# EAGLE design board (EAGLE 9.6.2)
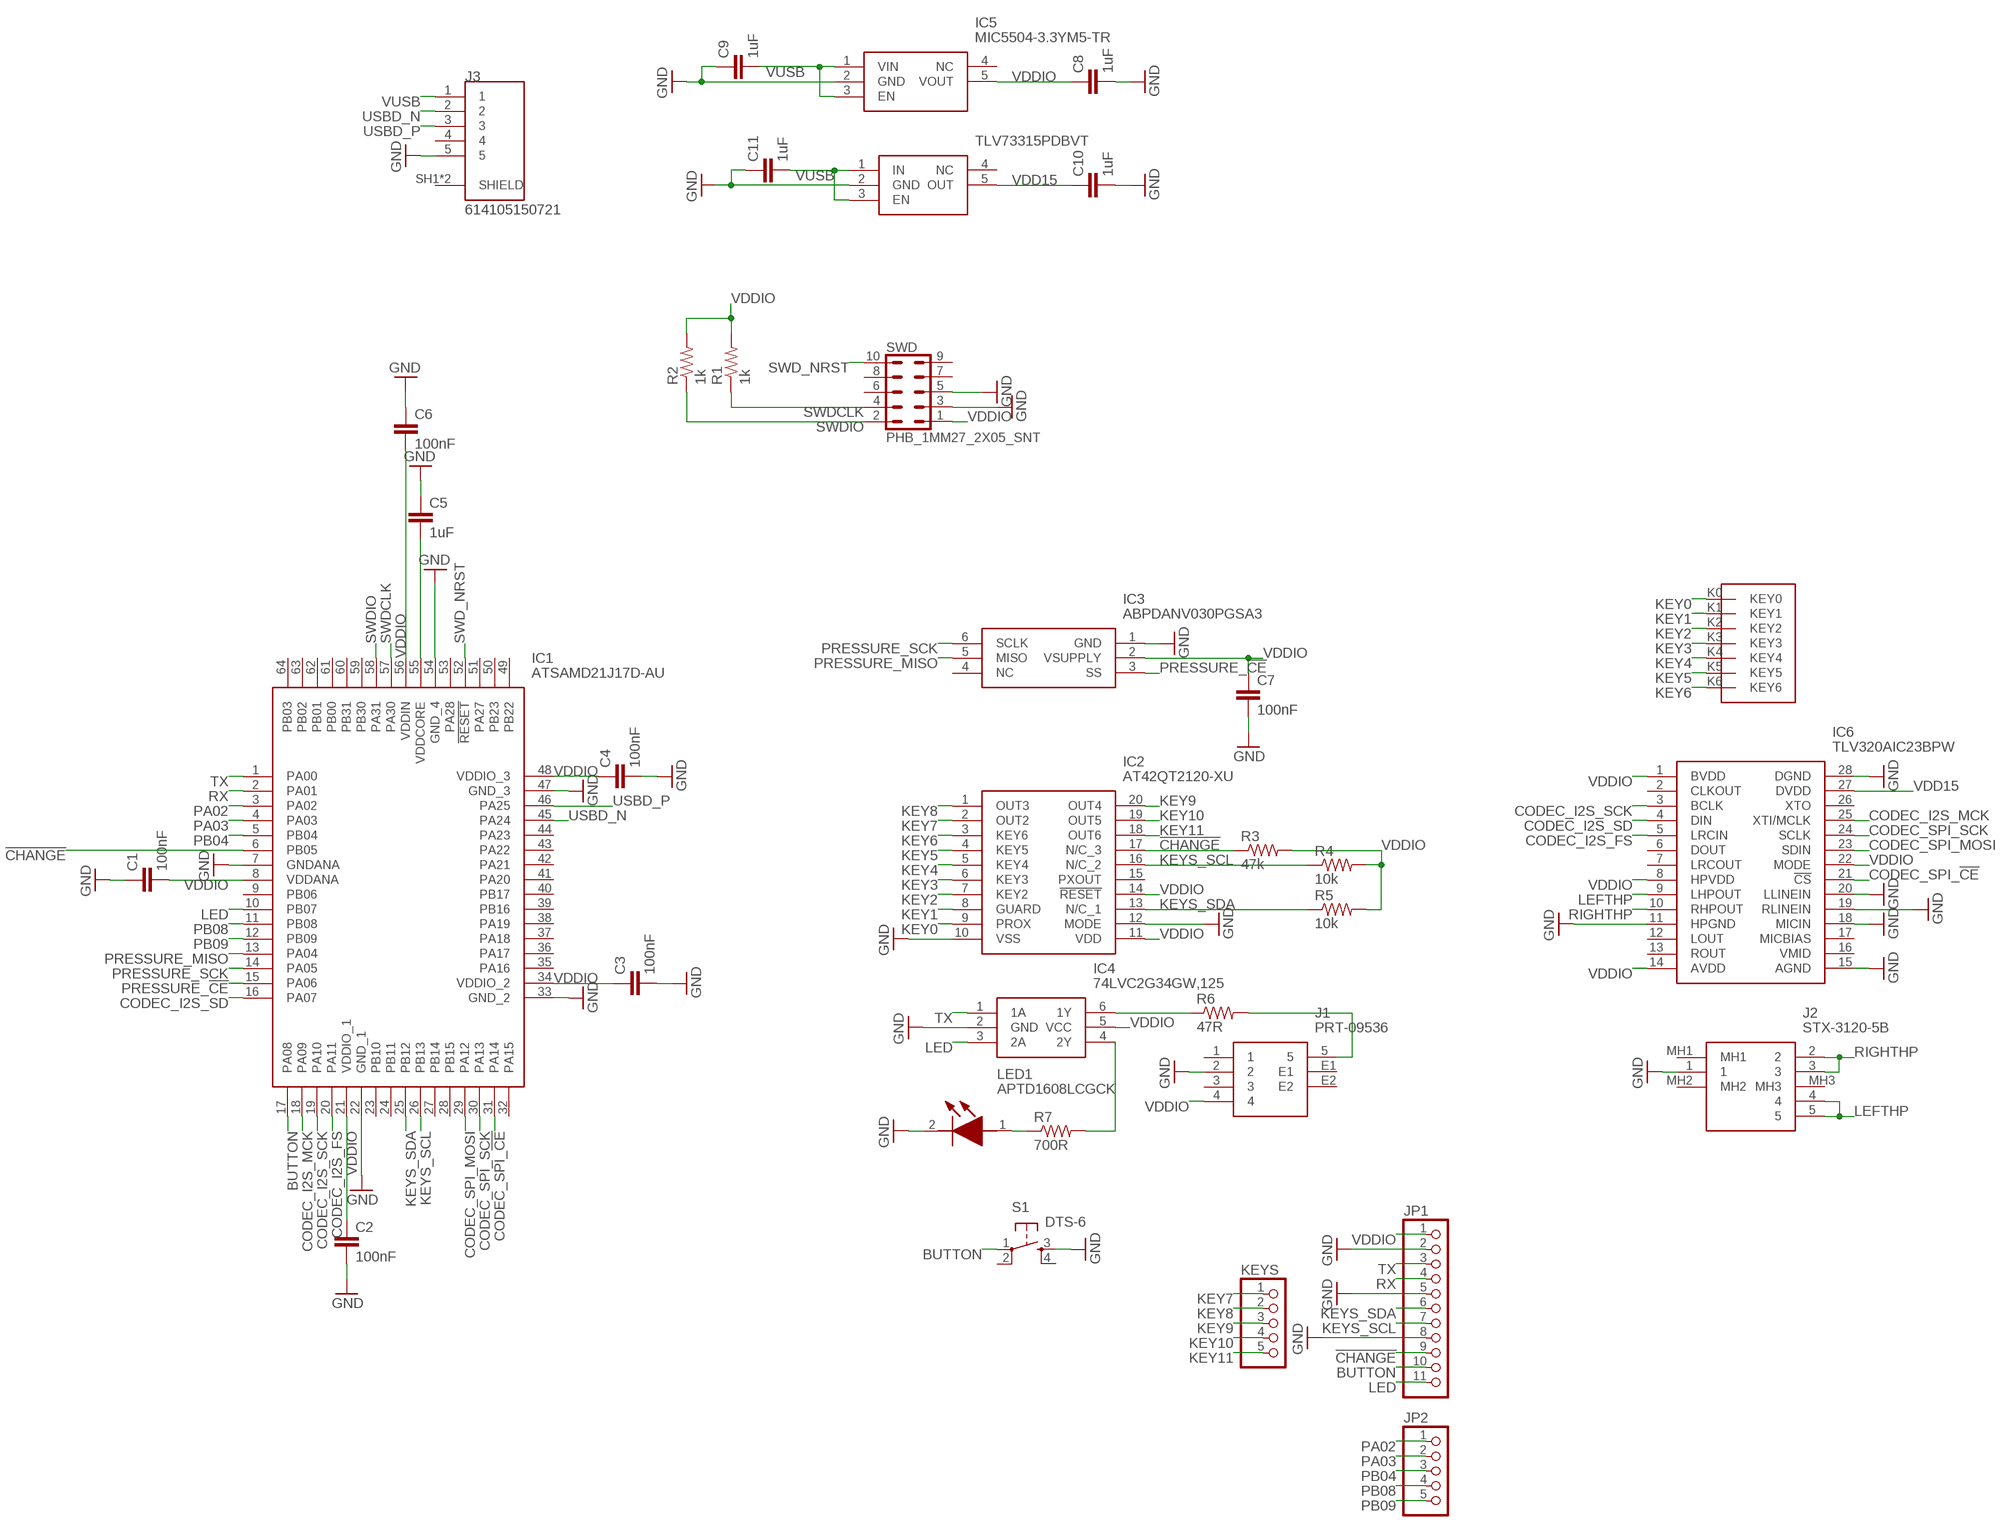
[diagram p0: schematic, sheet 1]

## Parts
C1  100nF  C-EUC0603  [C0603]
C2  100nF  C-EUC0603  [C0603]
C3  100nF  C-EUC0603  [C0603]
C4  100nF  C-EUC0603  [C0603]
C5  1uF  C-EUC0603  [C0603]
C6  100nF  C-EUC0603  [C0603]
C7  100nF  C-EUC0603  [C0603]
C8  1uF  C-EUC0603  [C0603]
C9  1uF  C-EUC0603  [C0603]
C10  1uF  C-EUC0603  [C0603]
C11  1uF  C-EUC0603  [C0603]
IC1  ATSAMD21J17D-AU  [QFP50P1200X1200X120-64N]
IC2  AT42QT2120-XU  [SOP65P638X120-20N]
IC3  ABPDANV030PGSA3  [ABPDANV030PGSA3]
IC4  74LVC2G34GW,125  [SOP65P210X110-6N]
IC5  MIC5504-3.3YM5-TR  [SOT95P280X145-5N]
IC6  TLV320AIC23BPW  [SOP65P640X120-28N]
J1  PRT-09536  [PRT09536]
J2  STX-3120-5B  [STX31205B]
J3  614105150721  [WURTH_614105150721]
JP1  PINHD-1X11  [1X11]
JP2  PINHD-1X5  [1X05]
KEYS  PINHD-1X5  [1X05]
LED1  APTD1608LCGCK  [APT1608CGCK]
R1  1k  R-US_R0603  [R0603]
R2  1k  R-US_R0603  [R0603]
R3  47k  R-US_R0603  [R0603]
R4  10k  R-US_R0603  [R0603]
R5  10k  R-US_R0603  [R0603]
R6  47R  R-US_R0603  [R0603]
R7  700R  R-US_R0603  [R0603]
S1  DTS-6  [DTS-6]
SWD  PHB_1MM27_2X05_SNT  [PHB_1MM27_2X05_SNT]
TLV73315PDBVT  TLV73333PDBVT  [SOT95P280X145-5N]
U$1  KEYS  [KEYS]

## Nets
!CHANGE!: IC1.6(PB05) IC2.17(N/C_3) JP1.9 R3.1
BUTTON: IC1.17(PA08) JP1.10 S1.1
CODEC_I2S_FS: IC1.20(PA11) IC6.5(LRCIN)
CODEC_I2S_MCK: IC1.18(PA09) IC6.25(XTI/MCLK)
CODEC_I2S_SCK: IC1.19(PA10) IC6.3(BCLK)
CODEC_I2S_SD: IC1.16(PA07) IC6.4(DIN)
CODEC_SPI_!CE!: IC1.31(PA14) IC6.21(!CS)
CODEC_SPI_MOSI: IC1.29(PA12) IC6.23(SDIN)
CODEC_SPI_SCK: IC1.30(PA13) IC6.24(SCLK)
GND: C1.1 C2.2 C3.2 C4.2 C5.1 C6.1 C7.2 C8.2 C9.1 C10.2 C11.1 IC1.7(GNDANA) IC1.22(GND_1) IC1.33(GND_2) IC1.47(GND_3) IC1.54(GND_4) IC2.10(VSS) IC2.12(MODE) IC3.1(GND) IC4.2(GND) IC5.2(GND) IC6.11(HPGND) IC6.15(AGND) IC6.18(MICIN) IC6.19(RLINEIN) IC6.20(LLINEIN) IC6.28(DGND) J1.2 J2.1 J3.5 JP1.2 JP1.5 JP1.8 LED1.2(K) S1.3 SWD.3 SWD.5 TLV73315PDBVT.2(GND)
KEY0: IC2.9(PROX) U$1.K0(KEY0)
KEY1: IC2.8(GUARD) U$1.K1(KEY1)
KEY2: IC2.7(KEY2) U$1.K2(KEY2)
KEY3: IC2.6(KEY3) U$1.K3(KEY3)
KEY4: IC2.5(KEY4) U$1.K4(KEY4)
KEY5: IC2.4(KEY5) U$1.K5(KEY5)
KEY6: IC2.3(KEY6) U$1.K6(KEY6)
KEY7: IC2.2(OUT2) KEYS.1
KEY8: IC2.1(OUT3) KEYS.2
KEY9: IC2.20(OUT4) KEYS.3
KEY10: IC2.19(OUT5) KEYS.4
KEY11: IC2.18(OUT6) KEYS.5
KEYS_SCL: IC1.26(PB13) IC2.16(N/C_2) JP1.7 R4.1
KEYS_SDA: IC1.25(PB12) IC2.13(N/C_1) JP1.6 R5.1
LED: IC1.10(PB07) IC4.3(2A) JP1.11
LEFTHP: IC6.9(LHPOUT) J2.4 J2.5
N$1: IC4.4(2Y) R7.2
N$2: J1.5 R6.2
N$3: C5.2 IC1.55(VDDCORE)
N$6: LED1.1(A) R7.1
N$7: IC4.6(1Y) R6.1
PA02: IC1.3(PA02) JP2.1
PA03: IC1.4(PA03) JP2.2
PB04: IC1.5(PB04) JP2.3
PB08: IC1.11(PB08) JP2.4
PB09: IC1.12(PB09) JP2.5
PRESSURE_!CE!: IC1.15(PA06) IC3.3(SS)
PRESSURE_MISO: IC1.13(PA04) IC3.5(MISO)
PRESSURE_SCK: IC1.14(PA05) IC3.6(SCLK)
RIGHTHP: IC6.10(RHPOUT) J2.2 J2.3
RX: IC1.2(PA01) JP1.4
SWD_NRST: IC1.52(!RESET) SWD.10
SWDCLK: IC1.57(PA30) R1.1 SWD.4
SWDIO: IC1.58(PA31) R2.1 SWD.2
TX: IC1.1(PA00) IC4.1(1A) JP1.3
USBD_N [differentials]: IC1.45(PA24) J3.2
USBD_P [differentials]: IC1.46(PA25) J3.3
VDD15: C10.1 IC6.27(DVDD) TLV73315PDBVT.5(OUT)
VDDIO: C1.2 C2.1 C3.1 C4.1 C6.2 C7.1 C8.1 IC1.8(VDDANA) IC1.21(VDDIO_1) IC1.34(VDDIO_2) IC1.48(VDDIO_3) IC1.56(VDDIN) IC2.11(VDD) IC2.14(!RESET) IC3.2(VSUPPLY) IC4.5(VCC) IC5.5(VOUT) IC6.1(BVDD) IC6.8(HPVDD) IC6.14(AVDD) IC6.22(MODE) J1.4 JP1.1 R1.2 R2.2 R3.2 R4.2 R5.2 SWD.1
VUSB: C9.2 C11.2 IC5.1(VIN) IC5.3(EN) J3.1 TLV73315PDBVT.1(IN) TLV73315PDBVT.3(EN)
Unconnected: IC1.9(PB06) IC1.23(PB10) IC1.24(PB11) IC1.27(PB14) IC1.28(PB15) IC1.32(PA15) IC1.35(PA16) IC1.36(PA17) IC1.37(PA18) IC1.38(PA19) IC1.39(PB16) IC1.40(PB17) IC1.41(PA20) IC1.42(PA21) IC1.43(PA22) IC1.44(PA23) IC1.49(PB22) IC1.50(PB23) IC1.51(PA27) IC1.53(PA28) IC1.59(PB30) IC1.60(PB31) IC1.61(PB00) IC1.62(PB01) IC1.63(PB02) IC1.64(PB03) IC2.15(PXOUT) IC3.4(NC) IC5.4(NC) IC6.2(CLKOUT) IC6.6(DOUT) IC6.7(LRCOUT) IC6.12(LOUT) IC6.13(ROUT) IC6.16(VMID) IC6.17(MICBIAS) IC6.26(XTO) J1.1 J1.3 J1.E1 J1.E2 J2.MH1 J2.MH2 J2.MH3 J3.4 J3.SH1(SHIELD) J3.SH2(SHIELD) S1.2 S1.4 SWD.6 SWD.7 SWD.8 SWD.9 TLV73315PDBVT.4(NC)

## Library data of the parts
C1-C11 = rcl:C-EU: CAPACITOR, European symbol; SPICEPREFIX: C
IC1 = ATSAMD21J17D-AU:ATSAMD21J17D-AU: 64TQFP IND TEMP, GREEN,1.6-3.6V,48MHz Source: Datasheet <http://ww1.microchip.com/downloads/en/DeviceDoc/SAMD21-Family-DataSheet-DS40001882D.pdf>; ARROW_PART_NUMBER: ATSAMD21J17D-AU; ARROW_PRICE-STOCK: https://www.arrow.com/en/products/atsamd21j17d-au/microchip-technology; DESCRIPTION: 64TQFP IND TEMP, GREEN,1.6-3.6V,48MHz; HEIGHT: 1.2mm; MANUFACTURER_NAME: Microchip; MANUFACTURER_PART_NUMBER: ATSAMD21J17D-AU; MOUSER_PART_NUMBER: 556-ATSAMD21J17D-AU; MOUSER_PRICE-STOCK: https://www.mouser.co.uk/ProductDetail/Microchip-Technology-Atmel/ATSAMD21J17D-AU?qs=byeeYqUIh0NPvYgWKbAwYw%3D%3D
IC2 = AT42QT2120-XU:AT42QT2120-XU: Capacitive Touch Sensors 12 channel AT42QT2120-XU, Spread-Spectrum Charge-Transfer Touch Screen Controller Serial-I2C, 20-Pin TSSOP Source: Datasheet <http://docs-emea.rs-online.com/webdocs/1441/0900766b81441bc2.pdf>; ARROW_PART_NUMBER: AT42QT2120-XU; ARROW_PRICE-STOCK: https://www.arrow.com/en/products/at42qt2120-xu/microchip-technology; DESCRIPTION: Capacitive Touch Sensors 12 channel AT42QT2120-XU, Spread-Spectrum Charge-Transfer Touch Screen Controller Serial-I2C, 20-Pin TSSOP; HEIGHT: 1.2mm; MANUFACTURER_NAME: Microchip; MANUFACTURER_PART_NUMBER: AT42QT2120-XU; MOUSER_PART_NUMBER: 556-AT42QT2120-XU; MOUSER_PRICE-STOCK: https://www.mouser.co.uk/ProductDetail/Microchip-Technology-Atmel/AT42QT2120-XU?qs=B3NtdMthFzEeaO%2FEAF407g%3D%3D
IC3 = ABPDANV030PGSA3:ABPDANV030PGSA3: Sensor: pressure; Range:030psi; gage; Output conf: SPI; Case: DIP Source: Datasheet <https://www.mouser.com/datasheet/2/187/honeywell-sensing-basic-board-mount-pressure-abp-s-1662208.pdf>; DESCRIPTION: Sensor: pressure; Range:030psi; gage; Output conf: SPI; Case: DIP; HEIGHT: 10.63mm; MANUFACTURER_NAME: Honeywell; MANUFACTURER_PART_NUMBER: ABPDANV030PGSA3; MOUSER_PART_NUMBER: 785-ABPDANV030PGSA3; MOUSER_PRICE-STOCK: https://www.mouser.co.uk/ProductDetail/Honeywell/ABPDANV030PGSA3?qs=OTrKUuiFdkYa4Au8z5Vftw%3D%3D
IC4 = 74LVC2G34GW_125:74LVC2G34GW,125: 74LVC2G34 - Dual buffer gate@en-us Source: Datasheet <https://assets.nexperia.com/documents/data-sheet/74LVC2G34.pdf>; ARROW_PART_NUMBER: 74LVC2G34GW,125; ARROW_PRICE-STOCK: https://www.arrow.com/en/products/74lvc2g34gw125/nexperia; DESCRIPTION: 74LVC2G34 - Dual buffer gate@en-us; HEIGHT: 1.1mm; MANUFACTURER_NAME: Nexperia; MANUFACTURER_PART_NUMBER: 74LVC2G34GW,125; MOUSER_PART_NUMBER: 771-LVC2G34GW125; MOUSER_PRICE-STOCK: https://www.mouser.co.uk/ProductDetail/Nexperia/74LVC2G34GW125/?qs=me8TqzrmIYUOkg5J0C6mqA%3D%3D
IC5 = MIC5504-3.3YM5-TR:MIC5504-3.3YM5-TR: MICROCHIP - MIC5504-3.3YM5-TR - LDO VOLT REG, 0.3A, 3.3V, SOT-23-5 Source: Datasheet <https://componentsearchengine.com/Datasheets/2/MIC5504-3.3YM5-TR.pdf>; ARROW_PART_NUMBER: MIC5504-3.3YM5-TR; ARROW_PRICE-STOCK: https://www.arrow.com/en/products/mic5504-3.3ym5-tr/microchip-technology; DESCRIPTION: MICROCHIP - MIC5504-3.3YM5-TR - LDO VOLT REG, 0.3A, 3.3V, SOT-23-5; HEIGHT: 1.45mm; MANUFACTURER_NAME: Microchip; MANUFACTURER_PART_NUMBER: MIC5504-3.3YM5-TR; MOUSER_PART_NUMBER: 998-MIC5504-3.3YM5TR; MOUSER_PRICE-STOCK: https://www.mouser.co.uk/ProductDetail/Microchip-Technology-Micrel/MIC5504-33YM5-TR/?qs=U6T8BxXiZAUmVQ5Zs217qQ%3D%3D
IC6 = TLV320AIC23BPW:TLV320AIC23BPW: TLV320AIC23BPWG4, Audio Codec 2 (ADC), 2 (DAC)-channel 32bit- 96ksps Serial-SPI 28-Pin TSSOP Source: Datasheet <http://www.ti.com/lit/ds/symlink/tlv320aic23b.pdf>; ARROW_PART_NUMBER: TLV320AIC23BPW; ARROW_PRICE-STOCK: https://www.arrow.com/en/products/tlv320aic23bpw/texas-instruments; DESCRIPTION: TLV320AIC23BPWG4, Audio Codec 2 (ADC), 2 (DAC)-channel 32bit- 96ksps Serial-SPI 28-Pin TSSOP; HEIGHT: 1.2mm; MANUFACTURER_NAME: Texas Instruments; MANUFACTURER_PART_NUMBER: TLV320AIC23BPW; MOUSER_PART_NUMBER: 595-TLV320AIC23BPW; MOUSER_PRICE-STOCK: https://www.mouser.co.uk/ProductDetail/Texas-Instruments/TLV320AIC23BPW/?qs=m96fseALk3VZOvtNFlSOrg%3D%3D
J1 = PRT-09536:PRT-09536: SparkFun Accessories MIDI Connector - Female Right Angle Source: Datasheet <https://www.sparkfun.com/datasheets/Prototyping/Connectors/MIDI-RA.pdf>; DESCRIPTION: SparkFun Accessories MIDI Connector - Female Right Angle; HEIGHT: 19.5mm; MANUFACTURER_NAME: SparkFun; MANUFACTURER_PART_NUMBER: PRT-09536; MOUSER_PART_NUMBER: 474-PRT-09536; MOUSER_PRICE-STOCK: https://www.mouser.co.uk/ProductDetail/SparkFun/PRT-09536?qs=WyAARYrbSnYl1e2cwkZPbQ%3D%3D
J2 = STX-3120-5B:STX-3120-5B: KYCON - STX-3120-5B - STEREO JACK, 3.5MM, 5POS, PBT GF, PCB Source: Datasheet <http://www.kycon.com/Pub_Eng_Draw/STX-3120-5B.pdf>; DESCRIPTION: KYCON - STX-3120-5B - STEREO JACK, 3.5MM, 5POS, PBT GF, PCB; HEIGHT: 10mm; MANUFACTURER_NAME: Kycon; MANUFACTURER_PART_NUMBER: STX-3120-5B; MOUSER_PART_NUMBER: 806-STX-3120-5B; MOUSER_PRICE-STOCK: https://www.mouser.co.uk/ProductDetail/Kycon/STX-3120-5B/?qs=3kl6BaT4OLI2eL%2FHybGK%2FQ%3D%3D
J3 = 614105150721:614105150721: Vertical Through Hole; sion 2.0 Micro USB Connector Socket Check prices <https://pricing.snapeda.com/parts/614105150721/W%C3%BCrth%20Elektronik/view-part?ref=eda>; AVAILABILITY: Warning; DESCRIPTION: USB - micro B USB 2.0 Receptacle Connector 5 Position Through Hole; MF: Würth Elektronik; MP: 614105150721; PACKAGE: None; PRICE: None; PURCHASE-URL: https://pricing.snapeda.com/search/part/614105150721/?ref=eda
JP1 = pinhead:PINHD-1X11: PIN HEADER
JP2 KEYS = pinhead:PINHD-1X5: PIN HEADER
LED1 = APTD1608LCGCK:APTD1608LCGCK: Standard LEDs - SMD 0603 Dome Lens LED Green- 570nm Source: Datasheet <https://mouser.componentsearchengine.com/Datasheets/1/APTD1608LCGCK.pdf>; DESCRIPTION: Standard LEDs - SMD 0603 Dome Lens LED Green- 570nm; HEIGHT: mm; MANUFACTURER_NAME: Kingbright; MANUFACTURER_PART_NUMBER: APTD1608LCGCK; MOUSER_PART_NUMBER: 604-APTD1608LCGCK; MOUSER_PRICE-STOCK: https://www.mouser.co.uk/ProductDetail/Kingbright/APTD1608LCGCK/?qs=AQlKX63v8Rv%252Bp7eo1xBjCA%3D%3D
R1-R7 = rcl:R-US_: RESISTOR, American symbol; SPICEPREFIX: R
S1 = switch-tact:DTS-6
SWD = _hhn_con_pinhead_box_1mm27:PHB_1MM27_2X05_*: Pin Header Box-Type, 1.27mm/0.5"/50mil Pitch, 2x05 Circuits Note: see library description for an important note about THT-version
TLV73315PDBVT = TLV3333PDBVT:TLV73333PDBVT: Capacitor-free 300-mA low-dropout (LDO) regulator with foldback current limit for portable devices Source: Datasheet <http://www.ti.com/lit/ds/symlink/tlv733p.pdf>; ARROW_PART_NUMBER: TLV73333PDBVT; ARROW_PRICE-STOCK: https://www.arrow.com/en/products/tlv73333pdbvt/texas-instruments; DESCRIPTION: Capacitor-free 300-mA low-dropout (LDO) regulator with foldback current limit for portable devices; HEIGHT: 1.45mm; MANUFACTURER_NAME: Texas Instruments; MANUFACTURER_PART_NUMBER: TLV73333PDBVT; MOUSER_PART_NUMBER: 595-TLV73333PDBVT; MOUSER_PRICE-STOCK: https://www.mouser.co.uk/ProductDetail/Texas-Instruments/TLV73333PDBVT/?qs=ifm8N2Kdrcam8xfmi4tOsQ%3D%3D
U$1 = talabard:KEYS

## Board
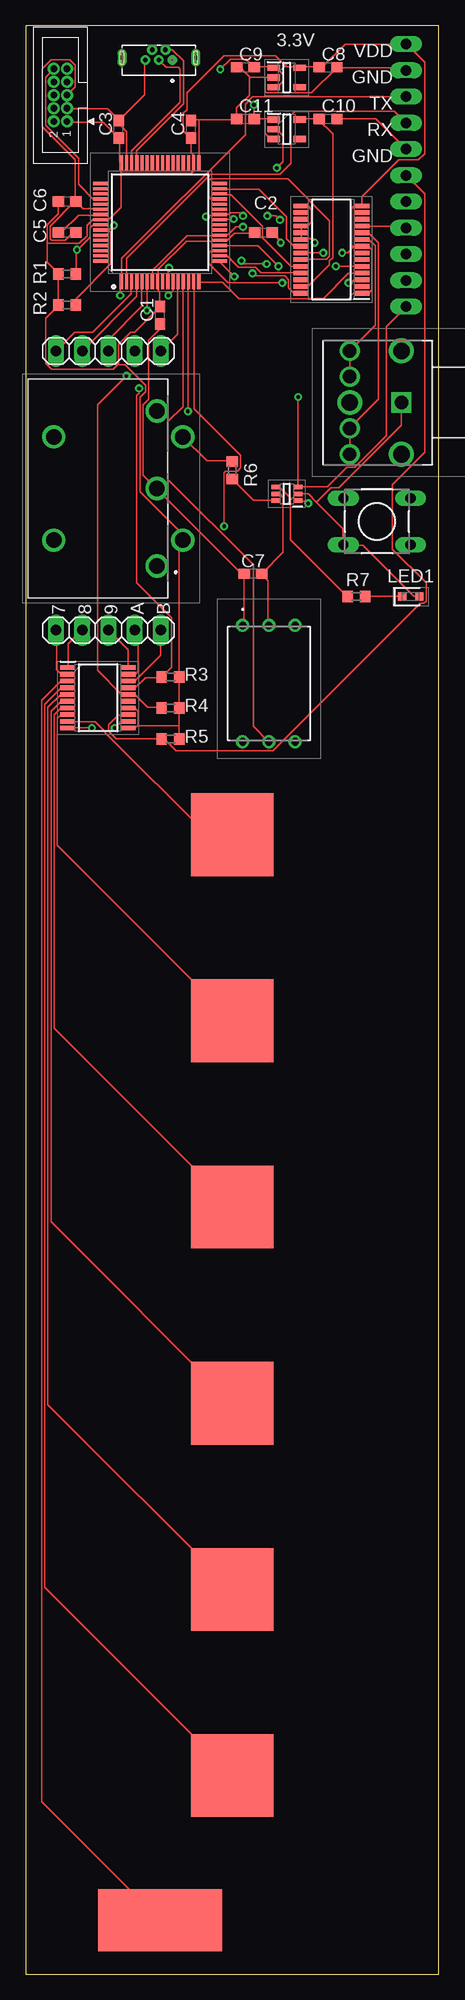
[diagram p1: board, top side]
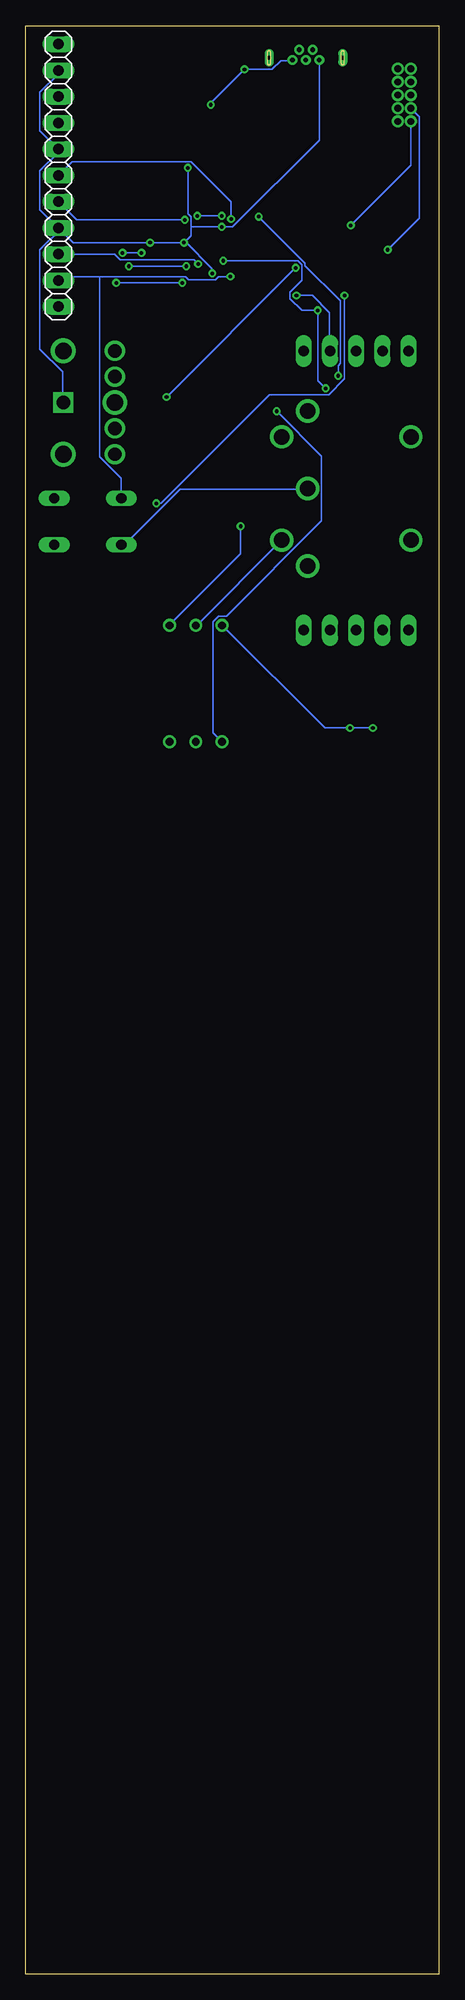
[diagram p2: board, bottom side, seen from below]

Size 40 x 188.46 mm. Coordinates in mm from the lower left corner, seen from the top.
Outline: 0,0 40,0 40,188.46 0,188.46 0,0
Copper layers (1*16): Top 0.035mm / dielectric 1.5mm / Bottom 0.035mm
Design rules "default": minimum track width 6mil, minimum drill 0.35mm, track to track 6mil, track to pad 6mil, pad to pad 6mil, via to via 6mil, smd to smd 6mil, copper to edge 40mil, drill to drill 6mil, minimum pad ring 10mil, minimum via ring 8mil, stop-mask expansion 4mil, vias tented up to drill 0mil, thermal gap 10mil

### Footprints (pad centres in the part's own frame; a part is rotated, then mirrored left to right if it is on the bottom)
C0603 = smd 1.1 x 1: 1 -0.85,0; 2 0.85,0
QFP50P1200X1200X120-64N = smd 1.475 x 0.3: 1 -5.738,3.75; 2 -5.738,3.25; 3 -5.738,2.75; 4 -5.738,2.25; 5 -5.738,1.75; 6 -5.738,1.25; 7 -5.738,0.75; 8 -5.738,0.25; 9 -5.738,-0.25; 10 -5.738,-0.75; 11 -5.738,-1.25; 12 -5.738,-1.75; 13 -5.738,-2.25; 14 -5.738,-2.75; 15 -5.738,-3.25; 16 -5.738,-3.75; 33 5.738,-3.75; 34 5.738,-3.25; 35 5.738,-2.75; 36 5.738,-2.25; 37 5.738,-1.75; 38 5.738,-1.25; 39 5.738,-0.75; 40 5.738,-0.25; 41 5.738,0.25; 42 5.738,0.75; 43 5.738,1.25; 44 5.738,1.75; 45 5.738,2.25; 46 5.738,2.75; 47 5.738,3.25; 48 5.738,3.75 | smd 0.3 x 1.475: 17 -3.75,-5.738; 18 -3.25,-5.738; 19 -2.75,-5.738; 20 -2.25,-5.738; 21 -1.75,-5.738; 22 -1.25,-5.738; 23 -0.75,-5.738; 24 -0.25,-5.738; 25 0.25,-5.738; 26 0.75,-5.738; 27 1.25,-5.738; 28 1.75,-5.738; 29 2.25,-5.738; 30 2.75,-5.738; 31 3.25,-5.738; 32 3.75,-5.738; 49 3.75,5.738; 50 3.25,5.738; 51 2.75,5.738; 52 2.25,5.738; 53 1.75,5.738; 54 1.25,5.738; 55 0.75,5.738; 56 0.25,5.738; 57 -0.25,5.738; 58 -0.75,5.738; 59 -1.25,5.738; 60 -1.75,5.738; 61 -2.25,5.738; 62 -2.75,5.738; 63 -3.25,5.738; 64 -3.75,5.738
SOP65P638X120-20N = smd 1.45 x 0.45: 1 -2.925,2.925; 2 -2.925,2.275; 3 -2.925,1.625; 4 -2.925,0.975; 5 -2.925,0.325; 6 -2.925,-0.325; 7 -2.925,-0.975; 8 -2.925,-1.625; 9 -2.925,-2.275; 10 -2.925,-2.925; 11 2.925,-2.925; 12 2.925,-2.275; 13 2.925,-1.625; 14 2.925,-0.975; 15 2.925,-0.325; 16 2.925,0.325; 17 2.925,0.975; 18 2.925,1.625; 19 2.925,2.275; 20 2.925,2.925
ABPDANV030PGSA3 = drill 0.73 pad 1.251: 1 0,0; 2 2.54,0; 3 5.08,0; 4 5.08,-11.25; 5 2.54,-11.25; 6 0,-11.25
SOP65P210X110-6N = smd 0.875 x 0.45: 1 -1.062,0.65; 2 -1.062,0; 3 -1.062,-0.65; 4 1.062,-0.65; 5 1.062,0; 6 1.062,0.65
SOT95P280X145-5N = smd 1.2 x 0.6: 1 -1.25,0.95; 2 -1.25,0; 3 -1.25,-0.95; 4 1.25,-0.95; 5 1.25,0.95
SOP65P640X120-28N = smd 1.475 x 0.45: 1 -2.938,4.225; 2 -2.938,3.575; 3 -2.938,2.925; 4 -2.938,2.275; 5 -2.938,1.625; 6 -2.938,0.975; 7 -2.938,0.325; 8 -2.938,-0.325; 9 -2.938,-0.975; 10 -2.938,-1.625; 11 -2.938,-2.275; 12 -2.938,-2.925; 13 -2.938,-3.575; 14 -2.938,-4.225; 15 2.938,-4.225; 16 2.938,-3.575; 17 2.938,-2.925; 18 2.938,-2.275; 19 2.938,-1.625; 20 2.938,-0.975; 21 2.938,-0.325; 22 2.938,0.325; 23 2.938,0.975; 24 2.938,1.625; 25 2.938,2.275; 26 2.938,2.925; 27 2.938,3.575; 28 2.938,4.225
PRT09536 = drill 1.5 pad 2.25: 1 0,0; 2 -7.5,0; 3 -15,0; 4 -2.5,2.5; 5 -12.5,2.5; E1 -2.5,-10; E2 -12.5,-10
STX31205B = drill 1.3 pad 1.95 square: 1 0,0 | drill 1.3 pad 1.95: 2 5,5; 3 5,2.5; 4 5,-2.5; 5 5,-5 | drill 1.6 pad 2.4: MH1 0,5; MH2 0,-5; MH3 5,0
WURTH_614105150721 = drill 0.44: 1 -1.3,0; 2 -0.65,-1; 3 0,0; 4 0.65,-1; 5 1.3,0 | drill 0.35 long: SH1 -3.575,-0.22; SH2 3.575,-0.22
1X11 = drill 1.016 long: 1 -12.7,0; 2 -10.16,0; 3 -7.62,0; 4 -5.08,0; 5 -2.54,0; 6 0,0; 7 2.54,0; 8 5.08,0; 9 7.62,0; 10 10.16,0; 11 12.7,0
1X05 = drill 1.016 long: 1 -5.08,0; 2 -2.54,0; 3 0,0; 4 2.54,0; 5 5.08,0
APT1608CGCK = smd 0.8 x 0.8: 1 -0.825,0; 2 0.825,0
R0603 = smd 1 x 1.1: 1 -0.85,0; 2 0.85,0
DTS-6 = drill 1 long: 1 -3.25,2.25; 2 3.25,2.25; 3 -3.25,-2.25; 4 3.25,-2.25
PHB_1MM27_2X05_SNT = drill 0.65: 1 -2.54,-0.635; 2 -2.54,0.635; 3 -1.27,-0.635; 4 -1.27,0.635; 5 0,-0.635; 6 0,0.635; 7 1.27,-0.635; 8 1.27,0.635; 9 2.54,-0.635; 10 2.54,0.635
KEYS = smd 8 x 8: K0 0,0; K1 0,-18; K2 0,-36; K3 0,-55; K4 0,-73; K5 0,-91 | smd 12 x 6: K6 -7,-105

### Placement (x,y rotation side)
C1  13,160.46 90 top
C2  23,168.46 0 top
C3  9,178.46 90 top
C4  16,178.46 90 top
C5  4,168.46 180 top
C6  4,171.46 180 top
C7  22,135.46 180 top
C8  29.27,184.46 0 top
C9  21.27,184.46 0 top
C10  29.27,179.46 0 top
C11  21.27,179.46 0 top
IC1  13,169.46 90 top
IC2  7,123.46 0 top
IC3  21,130.46 0 top
IC4  25.27,143.19 180 top
IC5  25.27,183.46 0 top
IC6  29.58,166.82 180 top
J1  12.71,136.21 270 top
J2  36.37,152.02 180 top
J3  12.88,185.15 180 top
JP1  36.83,173.99 270 bottom
JP2  8,157 0 top
KEYS  8,130 0 top
LED1  37.27,133.25 0 top
R1  4,164.46 180 top
R2  4,161.46 180 top
R3  14,125.46 0 top
R4  14,122.46 0 top
R5  14,119.46 0 top
R6  20,145.46 90 top
R7  32,133.25 180 top
S1  34,140.52 0 top
SWD  3.35,181.76 90 top
TLV73315PDBVT  25.27,178.46 0 top
U$1  20,110.22 0 top

### Tracks (layer width: path | path; a pad name or v marks a point on that pad's centre or on a via)
!CHANGE!  (via drill 0.35)
  Top 0.152: IC2.17 9.98,124.51 10.67,124.51 11.58,125.42 13.11,125.42 R3.1 13.18,125.5 14.1,126.42 14.1,131.22 10.74,134.57 10.74,152.71 10.97,152.93 v10.97,153.39 | v11.73,160.93 11.73,163.68 IC1.6 | v23.32,165.43 21.18,165.43 v20.88,165.74
  Bottom 0.152: v10.97,153.39 11.73,154.15 v11.73,160.93 13.26,160.93 14.4,162.08 14.4,162.69 13.26,163.83 13.26,165.35 13.64,165.74 v20.88,165.74 | v23.32,165.43 23.7,165.81 30.86,165.81 31.39,166.34 36.8,166.34 JP1.9
BUTTON  (via drill 0.35)
  Top 0.152: v20.19,164.21 18.75,165.66 IC1.17
  Bottom 0.152: v20.19,164.21 21.34,164.21 21.64,163.91 24.23,163.91 24.54,164.21 32.84,164.21 | 32.84,164.21 36.42,164.21 36.8,163.83 JP1.10 | 32.84,164.21 32.84,146.76 30.79,144.7 30.79,142.8 S1.1
CODEC_I2S_FS  (via drill 0.35)
  Top 0.152: v30.02,165.2 32.46,165.2 IC6.5 | v24.46,165.2 22.48,167.18 18.75,167.18 IC1.20
  Bottom 0.152: v24.46,165.2 v30.02,165.2
CODEC_I2S_MCK
  Top 0.152: IC6.25 26.59,164.59 22.78,164.59 22.25,165.12 20.57,165.12 19.51,166.19 18.75,166.19 IC1.18
CODEC_I2S_SCK  (via drill 0.35)
  Top 0.152: v24.84,163.6 19.58,163.6 17.75,165.43 17.75,166.5 17.91,166.65 18.67,166.65 IC1.19 | v31.24,163.6 31.55,163.6 31.77,163.83 32.46,163.83 IC6.3
  Bottom 0.152: v31.24,163.6 v24.84,163.6
CODEC_I2S_SD
  Top 0.152: IC1.16 16.76,163.68 19.05,163.68 20.65,162.08 28.8,162.08 31.24,164.52 32.46,164.52 IC6.4
CODEC_SPI_!CE!
  Top 0.152: IC6.21 26.59,167.18 25.91,167.18 25.22,167.87 25.22,170 22.55,172.67 18.75,172.67 IC1.31
CODEC_SPI_MOSI
  Top 0.152: IC6.23 26.67,165.89 29.11,165.89 29.41,166.19 29.41,169.62 25.38,173.66 17.91,173.66 17.75,173.51 17.75,171.91 17.91,171.75 18.67,171.75 IC1.29
CODEC_SPI_SCK
  Top 0.152: IC6.24 26.59,165.2 25.68,165.2 22.94,167.94 22.94,169.09 19.89,172.14 18.75,172.14 IC1.30
GND  (via drill 0.35)
  Top 0.152: C1.1 12.95,159.56 12.95,159.11 11.89,158.04 11.89,152.32 11.35,151.79 11.35,145.01 12.65,143.71 J1.2 12.72,143.64 20.95,135.41 21.03,135.41 C7.2 21.11,135.41 21.11,130.61 21.03,130.53 IC3.1 | v6.4,120.55 4.12,120.55 IC2.10 | v8.61,120.55 9.22,121.16 9.91,121.16 IC2.12 | 21.68,183.53 21.72,183.49 23.16,183.49 | 21.68,183.53 20.8,184.4 20.42,184.4 C9.1 | 23.16,183.49 24,183.49 IC5.2 | 16.76,179.38 20.27,179.38 20.34,179.45 C11.1 20.42,179.53 20.42,180.52 21.64,181.74 21.64,183.49 21.68,183.53 | 16.76,179.38 16,179.38 C4.2 | 16.76,179.38 16.76,175.26 IC1.33 | JP1.2 36.58,184.4 30.18,184.4 C8.2 30.1,184.4 27.66,181.97 23.32,181.97 23.16,182.12 23.16,183.49 | JP1.5 33.91,179.45 30.18,179.45 C10.2 | LED1.2 38.02,133.27 37.57,133.27 32.61,138.23 30.79,138.23 S1.3 30.71,138.3 30.71,139.83 28.16,142.38 | 28.16,142.38 27.36,143.18 26.36,143.18 IC4.2 | 28.16,142.38 29.57,143.79 30.33,143.79 36.35,149.81 36.35,152.02 J2.1 | C5.1 4.8,168.4 4.5,168.4 3.81,167.72 2.52,167.72 2.36,167.87 2.36,169.09 4.8,171.53 C6.1 | IC1.54 7.24,170.76 5.56,170.76 4.88,171.45 C6.1 | C3.2 9.07,179.3 9.07,178.92 9.75,178.23 9.75,175.26 IC1.47 | J3.5 11.51,185.09 11.51,181.81 9.07,179.38 C3.2 | C3.2 8.99,179.38 7.92,180.44 4.04,180.44 SWD.3 3.96,180.52 3.96,181.74 SWD.5 4.04,181.81 4.8,182.57 4.8,184.63 4.27,185.17 2.44,185.17 1.6,184.33 1.6,178.69 4.8,175.49 4.8,171.6 C6.1 | IC1.7 12.27,163.75 12.27,164.82 15.62,168.17 18.67,168.17 IC1.22 18.75,168.25 19.58,168.25 20.34,169.01 v21.03,169.01 | IC6.15 26.67,170.99 27.36,170.99 27.66,170.69 27.66,169.47 27.28,169.09 26.75,169.09 IC6.18 26.67,169.09 26.67,168.48 IC6.19 26.67,168.4 26.67,167.87 IC6.20 26.75,167.87 27.58,167.87 v27.96,167.49
  Top 0.152: v24.69,167.49 24.69,167.56 23.85,168.4 C2.2 | v24.31,174.73 24.92,175.34 24.92,177.85 24.38,178.38 24.08,178.38 TLV73315PDBVT.2 | v21.95,164.52 22.17,164.29 25.07,164.29 25.45,163.91 25.45,163.14 25.98,162.61 26.59,162.61 IC6.28 | JP1.8 36.65,169.09 32.54,169.09 IC6.11
  Bottom 0.152: v6.4,120.55 v8.61,120.55 11.05,120.55 20.95,130.45 IC3.1 | JP1.2 36.88,184.1 36.88,183.79 38.63,182.04 38.63,178.31 36.88,176.56 JP1.5 36.88,176.48 36.88,176.17 38.63,174.42 38.63,170.69 36.88,168.94 JP1.8 | v24.69,167.49 v27.96,167.49 35.43,167.49 36.8,168.86 JP1.8 | v24.31,174.73 24.31,170.31 24,170 24,169.01 | 24,169.01 24,168.17 v24.69,167.49 | v21.95,164.52 21.95,164.97 24.54,167.56 v24.69,167.49 | 24,169.01 v21.03,169.01 19.96,169.01 11.58,177.39 11.58,185.09 J3.5 | J2.1 36.42,152.09 36.42,154.99 38.63,157.2 38.63,166.8 36.73,168.71 JP1.8 | J1.2 12.72,143.64 25.07,143.64 30.4,138.3 30.71,138.3 S1.3
KEY0
  Top 0.152: IC2.9 4.12,121.16 6.71,121.16 7.7,120.17 7.7,120.09 17.53,110.26 19.96,110.26 U$1.K0
KEY1
  Top 0.152: IC2.8 4.04,121.77 3.35,121.77 3.05,121.46 3.05,109.19 19.96,92.28 U$1.K1
KEY2
  Top 0.152: IC2.7 4.04,122.45 3.35,122.45 2.74,121.84 2.74,91.52 19.96,74.3 U$1.K2
KEY3
  Top 0.152: IC2.6 4.04,123.06 3.35,123.06 2.44,122.15 2.44,72.77 19.96,55.24 U$1.K3
KEY4
  Top 0.152: IC2.5 4.04,123.75 3.35,123.75 2.13,122.53 2.13,55.09 19.96,37.26 U$1.K4
KEY5
  Top 0.152: IC2.4 4.04,124.44 3.43,124.44 1.83,122.83 1.83,37.41 19.96,19.28 U$1.K5
KEY6
  Top 0.152: IC2.3 4.04,125.04 3.35,125.04 1.52,123.22 1.52,16.69 12.95,5.26 U$1.K6
KEY7
  Top 0.152: IC2.2 4.04,125.81 3.35,125.81 2.97,126.19 2.97,130 KEYS.1
KEY8
  Top 0.152: IC2.1 4.12,126.42 4.12,128.7 5.41,130 KEYS.2
KEY9
  Top 0.152: IC2.20 9.91,126.42 9.91,128.09 KEYS.3
KEY10
  Top 0.152: IC2.19 9.98,125.81 10.67,125.81 10.9,126.03 10.9,129.69 10.59,130 KEYS.4
KEY11
  Top 0.152: IC2.18 9.98,125.12 10.59,125.12 13.03,127.56 13.03,130 KEYS.5
KEYS_SCL  (via drill 0.35)
  Top 0.152: R4.1 13.11,122.53 11.81,122.53 10.59,123.75 9.98,123.75 IC2.16 9.91,123.83 9.22,123.83 6.93,126.11 6.93,151.79 v9.75,154.61 | v21.03,170.08 20.73,170.38 19.81,170.38 19.66,170.23 18.75,170.23 IC1.26 18.67,170.16 17.91,170.16 17.75,170 v17.45,170 | v23.39,170.08 24.23,170.08 v24.61,169.7
  Bottom 0.152: v23.39,170.08 v21.03,170.08 | v24.61,169.7 35.05,169.7 36.8,171.45 JP1.7 | v9.75,154.61 9.75,155.6 9.53,155.83 9.53,161.85 12.95,165.28 12.95,165.51 v17.45,170
KEYS_SDA  (via drill 0.35)
  Top 0.152: IC2.13 9.91,121.77 8.91,121.77 8,120.85 8,120.24 8.76,119.48 13.11,119.48 R5.1 13.18,119.41 13.49,119.41 14.55,118.34 23.93,118.34 38.18,132.59 38.56,132.59 38.79,132.82 38.79,134.57 35.51,137.85 35.51,144.09 38.63,147.22 38.63,172.21 36.88,173.97 JP1.6 | v20.12,169.77 18.75,169.77 IC1.25
  Bottom 0.152: v20.12,169.77 20.12,171.45 24,175.34 35.51,175.34 36.8,174.04 JP1.6
LED  (via drill 0.35)
  Top 0.152: JP1.11 36.8,161.24 34.9,159.33 34.9,148.82 31.85,145.77 31.09,145.77 29.18,143.87 26.36,143.87 IC4.3 26.36,143.94 v26.36,152.55 | v13.87,165.05 13.79,164.97 13.79,163.75 IC1.10
  Bottom 0.152: v26.36,152.55 v13.87,165.05
LEFTHP
  Top 0.152: IC6.9 32.54,167.79 33.22,167.79 33.83,167.18 33.83,159.49 31.39,157.05 J2.5 31.39,156.97 31.39,154.53 J2.4
N$1
  Top 0.152: IC4.4 24.23,143.79 24.61,143.79 25.6,142.8 25.6,138.76 31.09,133.27 R7.2
N$2
  Top 0.152: R6.2 19.96,146.38 17.53,146.38 15.24,148.67 J1.5
N$3
  Top 0.152: C5.2 3.2,168.48 3.43,168.48 5.11,170.16 7.24,170.16 IC1.55
N$6
  Top 0.152: LED1.1 36.42,133.27 32.92,133.27 R7.1
N$7
  Top 0.152: IC4.6 24.16,142.57 22.02,142.57 20.04,144.55 R6.1
PA02
  Top 0.152: IC1.3 10.21,163.68 10.21,162.53 6.48,158.8 4.72,158.8 2.97,157.05 JP2.1
PA03
  Top 0.152: IC1.4 10.74,163.68 10.74,162.31 5.49,157.05 JP2.2
PB04
  Top 0.152: IC1.5 11.2,163.68 11.2,161.31 8,158.12 8,157.05 JP2.3
PB08  (via drill 0.35)
  Top 0.152: v13.79,162.38 14.25,162.84 14.25,163.68 IC1.11
  Bottom 0.152: v13.79,162.38 12.27,162.38 10.59,160.71 10.59,157.05 JP2.4
PB09
  Top 0.152: IC1.12 14.71,163.68 14.71,158.65 13.11,157.05 JP2.5
PRESSURE_!CE!  (via drill 0.35)
  Top 0.152: v19.2,140.06 19.2,145.24 19.36,145.39 20.5,145.39 20.8,145.69 20.8,146.91 16.31,151.41 16.31,163.68 IC1.15
  Bottom 0.152: v19.2,140.06 19.2,137.39 26.06,130.53 IC3.3
PRESSURE_MISO
  Top 0.152: IC1.13 15.24,163.68 15.24,151.64 13.79,150.19 13.79,144.55 22.02,136.32 22.02,120.7 23.47,119.25 IC3.5
PRESSURE_SCK  (via drill 0.35)
  Top 0.152: v15.7,151.18 15.7,163.68 IC1.14
  Bottom 0.152: v15.7,151.18 11.35,146.84 11.35,140.59 20.57,131.37 21.34,131.37 21.87,130.84 21.87,120.09 21.03,119.25 IC3.6
RIGHTHP
  Top 0.152: IC6.10 32.54,168.4 33.22,168.4 34.14,167.49 34.14,152.32 31.39,149.58 J2.3 31.39,149.5 31.39,147.07 J2.2
RX
  Top 0.152: IC1.2 9.75,163.75 9.75,165.96 17.91,174.12 24.61,174.12 25.68,175.18 25.68,179.83 26.06,180.21 35.66,180.21 36.8,179.07 JP1.4
SWD_NRST
  Top 0.152: IC1.52 7.24,171.75 6.48,171.75 5.11,173.13 5.11,175.64 1.91,178.84 1.91,183.49 2.67,184.25 SWD.10
SWDCLK  (via drill 0.35)
  Top 0.152: 4.99,166.76 6.25,168.02 6.25,168.94 6.48,169.16 7.24,169.16 IC1.57 | 4.99,166.76 4.88,166.65 4.88,164.52 R1.1 | v4.95,166.8 4.99,166.76
  Bottom 0.152: v4.95,166.8 1.91,169.85 1.91,179.68 2.67,180.44 SWD.4
SWDIO  (via drill 0.35)
  Top 0.152: 8.04,168.67 8,168.71 7.32,168.71 IC1.58 | 8.04,168.67 8.23,168.48 8.23,165.43 4.88,162.08 4.88,161.47 R2.1 | 8.04,168.67 v8.53,169.16
  Bottom 0.152: v8.53,169.16 2.74,174.96 2.74,179.15 SWD.2
TX  (via drill 0.35)
  Top 0.152: v27.36,142.26 27.13,142.49 26.36,142.49 IC4.1 | v9.14,162.38 9.14,163.6 9.22,163.68 IC1.1 9.3,163.75 9.3,165.96 21.26,177.93 21.26,180.9 21.95,181.59 36.8,181.59 JP1.3
  Bottom 0.152: v27.36,142.26 26.9,142.26 16.38,152.78 10.67,152.78 9.14,154.31 v9.14,162.38
USBD_N
  Top 0.152: IC1.45 10.75,176.29 10.72,176.33 10.72,176.39 15.26,180.94 15.26,185.06 14.17,186.15 J3.2
USBD_P
  Top 0.152: IC1.46 10.25,176.36 14.96,181.07 14.96,184.27 14.78,184.45 13.58,184.45 J3.3
VDD15
  Top 0.152: TLV73315PDBVT.5 26.59,179.45 28.35,179.45 C10.1 28.35,179.38 29.72,178 29.72,166.04 29.41,165.74 29.41,165.35 27.36,163.3 26.67,163.3 IC6.27
VDDIO  (via drill 0.35)
  Top 0.152: 10.86,120.81 10.9,120.85 10.9,122.15 10.59,122.45 9.98,122.45 IC2.14 | 10.86,120.81 10.59,120.55 9.98,120.55 IC2.11 | 14.86,120.78 R4.2 14.86,122.53 14.86,125.42 R3.2 14.86,125.5 14.86,138.38 15.16,138.68 J1.4 15.16,138.76 15.16,139.29 11.05,143.41 11.05,152.55 11.58,153.09 11.58,153.69 9.6,155.68 8.99,155.68 8.95,155.72 | 14.86,120.78 14.86,119.48 R5.2 | 14.86,120.78 10.9,120.78 10.86,120.81 | IC4.5 24.23,143.18 24.61,143.18 24.92,142.88 24.92,137.54 22.86,135.48 C7.1 22.86,135.41 23.47,134.8 23.47,130.53 IC3.2 | IC6.1 32.54,162.61 33.22,162.61 33.53,162.92 33.53,166.8 33.22,167.11 32.54,167.11 IC6.8 32.46,167.11 31.77,167.11 31.74,167.07 | v28.8,166.5 26.67,166.5 IC6.22 | v30.63,166.5 31.17,166.5 31.74,167.07 | 31.74,167.07 31.55,167.26 31.55,170.76 31.77,170.99 32.46,170.99 IC6.14 32.54,171.07 32.54,171.91 36.12,175.49 38.02,175.49 38.63,176.1 38.63,184.94 36.88,186.69 JP1.1 30.94,186.69 28.73,184.48 28.42,184.48 C8.1 28.35,184.48 26.59,184.48 IC5.5 26.52,184.48 25.22,184.48 24.16,185.55 19.2,185.55 15.62,181.97 15.62,180.37 15.24,179.98 15.24,178.31 15.93,177.62 C4.1 16,177.55 16,176.17 16.23,175.95 16.23,175.26 IC1.34 16.23,175.18 16.23,174.42 16,174.19 9.22,174.19 | C2.1 22.1,168.4 20.19,168.4 19.51,167.72 IC1.21 18.67,167.64 15.54,167.64 12.8,164.9 12.8,163.75 IC1.8 12.8,163.68 12.8,162.92 12.95,162.76 12.95,161.31 C1.2 12.95,161.24 10.52,158.8 10.13,158.8 8.99,157.66 8.99,155.75 8.95,155.72 | 2.06,167.41 2.06,165.58 3.12,164.52 R1.2 3.12,164.44 3.12,161.47 R2.2 3.12,161.39 1.91,160.17 1.91,155.83 2.52,155.22 8.46,155.22 8.95,155.72
  Top 0.152: 2.06,167.41 2.06,169.24 3.12,170.31 3.12,171.45 C6.2 | 9.22,174.19 9.22,175.18 IC1.48 9.22,175.26 9.07,175.41 9.07,177.55 C3.1 8.99,177.62 7.47,179.15 4.04,179.15 SWD.1 | 9.22,174.19 9.22,170.92 8.08,169.77 7.32,169.77 IC1.56 7.24,169.7 6.48,169.7 5.94,169.16 5.94,168.17 5.18,167.41 2.06,167.41
  Bottom 0.152: J1.4 15.24,138.68 23.47,130.45 IC3.2 | v30.63,166.5 v28.8,166.5
VUSB  (via drill 0.35)
  Top 0.152: 23.16,179.45 24,179.45 TLV73315PDBVT.1 | 23.16,179.45 22.17,179.45 C11.2 22.1,179.53 v22.1,180.82 | 23.16,179.45 23.16,178.08 23.7,177.55 24,177.55 TLV73315PDBVT.3 | IC5.3 24.08,182.57 24.38,182.57 24.92,183.11 24.92,183.79 24.31,184.4 24.08,184.4 IC5.1 24,184.48 22.17,184.48 C9.2 22.1,184.48 21.34,185.24 19.81,185.24 v18.82,184.25
  Bottom 0.152: J3.1 14.25,185.09 15.32,185.09 16.15,184.25 v18.82,184.25 22.1,180.97 v22.1,180.82

### Text on the board
tNames: VDD | 3.3V | GND | TX | RX | GND | 7 | 8 | 9 | A | B